# Altium project DevKitWRM1470-r1.0.PrjPcb
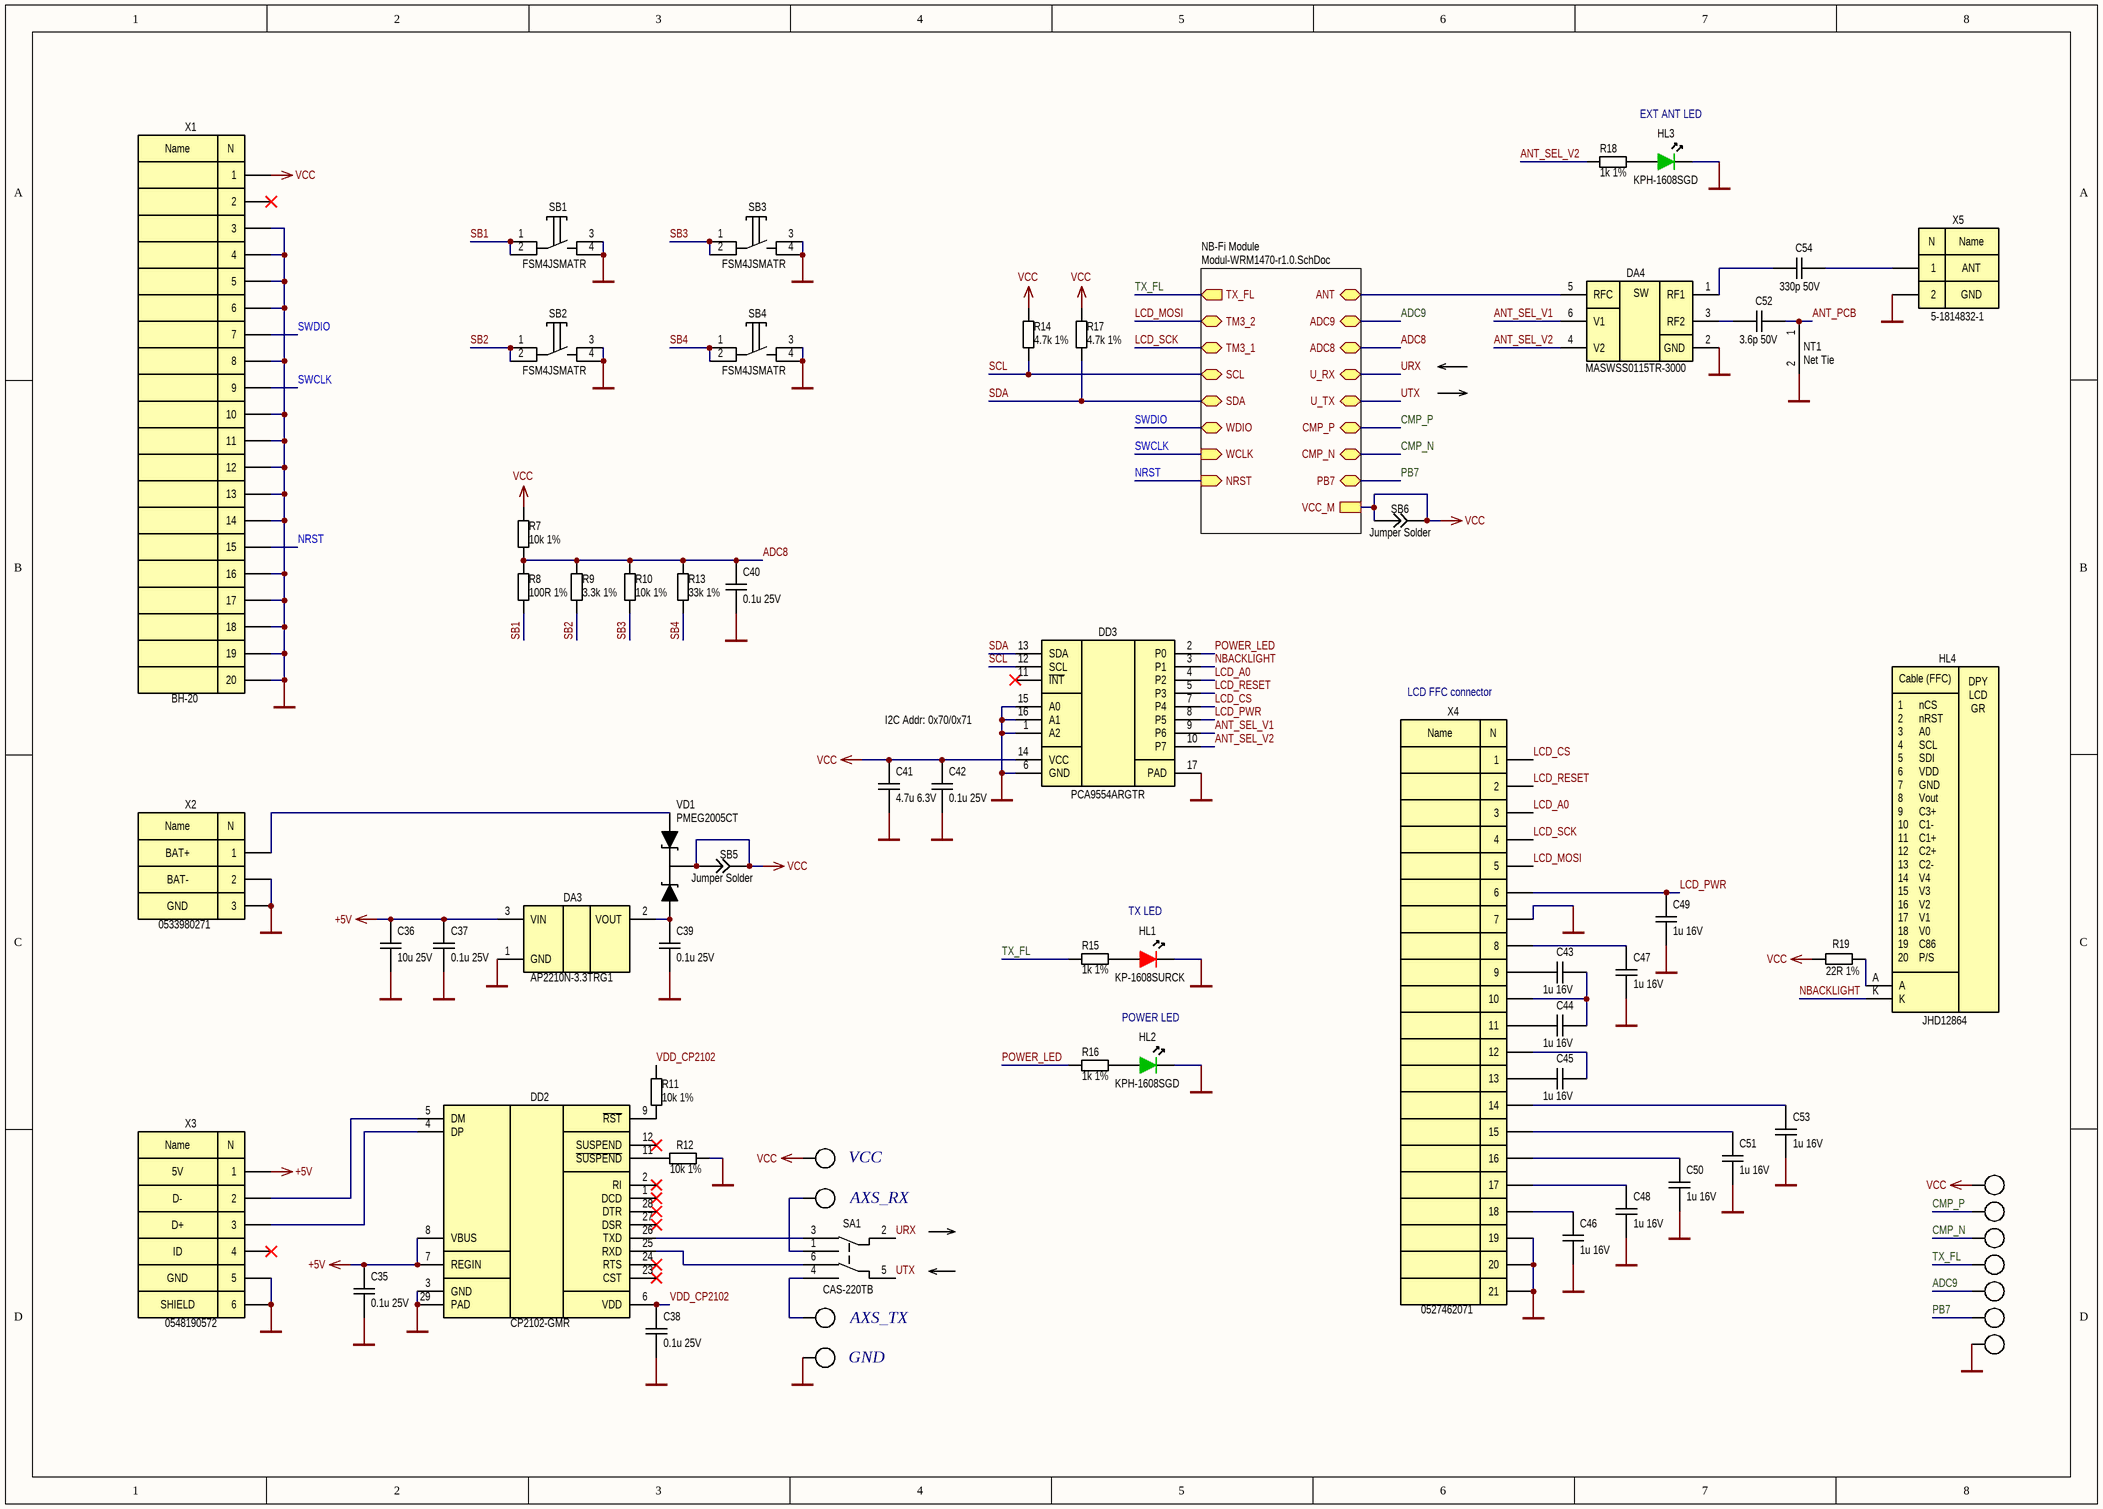
[diagram p0: DevKitWRM1470-r1.0.SchDoc]
2 sheets, 147 parts. Net scope: hierarchical (ports join the sheet entries above them; power ports are global).
Board file: DevKitWRM1470-r1.0.PcbDoc
Sheets:
  DevKitWRM1470-r1.0.SchDoc
    NB-Fi Module = Modul-WRM1470-r1.0.SchDoc

## Sheet DevKitWRM1470-r1.0.SchDoc
size A3; SheetNumber: 1; PageSetup: Record=PageOptions|CenterHorizontal=True|CenterVertical=True|PrintScale=0.52|XCorrection=1.00|YCorrection=1.00|PrintKind=1|BorderSize=5000000|LeftOffset=0|BottomOffset=0|Orientation=2|PaperLength=1000|PaperWidth=1000|Scale=100|PaperSource=7|PrintQuality=600|MediaType=1|DitherType=10|PaperKind=A4|PrintScaleMode=1

### Parts
C35  0.1u 25V  [C0402]
C36  10u 25V  [C0805]
C37  0.1u 25V  [C0402]
C38  0.1u 25V  [C0402]
C39  0.1u 25V  [C0402]
C40  0.1u 25V  [C0402]
C41  4.7u 6.3V  [C0402]
C42  0.1u 25V  [C0402]
C43  1u 16V  [C0402]
C44  1u 16V  [C0402]
C45  1u 16V  [C0402]
C46  1u 16V  [C0402]
C47  1u 16V  [C0402]
C48  1u 16V  [C0402]
C49  1u 16V  [C0402]
C50  1u 16V  [C0402]
C51  1u 16V  [C0402]
C52  3.6p 50V  [C0402]
C53  1u 16V  [C0402]
C54  330p 50V  [C0402]
DA3  AP2210N-3.3TRG1  [SOT23-3L]
DA4  MASWSS0115TR-3000  [SOT323-6]
DD2  CP2102-GMR  [QFN28]
DD3  PCA9554ARGTR  [QFN16]
HL1  KP-1608SURCK  [LED0603_RED]
HL2  KPH-1608SGD  [LED0603_GREEN]
HL3  KPH-1608SGD  [LED0603_GREEN]
HL4  JHD12864  [JHD12864]
NT1  Net Tie  [NETTIE-5.0x4.0]  (net tie, no BOM)
R7  10k 1%  [R0402]
R8  100R 1%  [R0402]
R9  3.3k 1%  [R0402]
R10  10k 1%  [R0402]
R11  10k 1%  [R0402]
R12  10k 1%  [R0402]
R13  33k 1%  [R0402]
R14  4.7k 1%  [R0402]
R15  1k 1%  [R0402]
R16  1k 1%  [R0402]
R17  4.7k 1%  [R0402]
R18  1k 1%  [R0402]
R19  22R 1%  [R0402]
SA1  CAS-220TB  [CAS-220]
SB1  FSM4JSMATR  [FSM4JSMATR]
SB2  FSM4JSMATR  [FSM4JSMATR]
SB3  FSM4JSMATR  [FSM4JSMATR]
SB4  FSM4JSMATR  [FSM4JSMATR]
SB5  Jumper Solder  [SB0805]  (no BOM)
SB6  Jumper Solder  [SB0805]  (no BOM)
VD1  PMEG2005CT  [SOT23-3L]
X1  BH-20  [BH-20_PCB]
X2  0533980271  [0533980271_PCB]
X3  0548190572  [0548190572]
X4  0527462071  [0527462071_PCB]
X5  5-1814832-1  [5-1814832-1]
XP1  PLS-1  [HDR1X1]  (value not drawn)
XP2  PLS-1  [HDR1X1]  (value not drawn)
XP3  PLS-1  [HDR1X1]  (value not drawn)
XP4  PLS-1  [HDR1X1]  (value not drawn)
XP5  PLS-1  [HDR1X1]  (value not drawn)
XP6  PLS-1  [HDR1X1]  (value not drawn)
XP7  PLS-1  [HDR1X1]  (value not drawn)
XP8  PLS-1  [HDR1X1]  (value not drawn)
XP9  PLS-1  [HDR1X1]  (value not drawn)
XP10  PLS-1  [HDR1X1]  (value not drawn)
XP11  PLS-1  [HDR1X1]  (value not drawn)

### Sub-sheets
NB-Fi Module = Modul-WRM1470-r1.0.SchDoc: ADC8 (bidir), TM3_2 (bidir), ADC9 (bidir), TM3_1 (bidir), SCL (bidir), SDA (bidir), WDIO (bidir), WCLK (in), NRST (in), U_RX (bidir), U_TX (bidir), CMP_P (bidir), CMP_N (bidir), ANT (bidir), TX_FL (out), PB7 (bidir), VCC_M

### Nets
+5V: C35.2 C36.1 C37.2 DA3.3(VIN) DD2.7(REGIN) DD2.8(VBUS) X3.1
GND: C35.1 C36.2 C37.1 C38.1 C39.1 C40.1 C41.1 C42.1 C46.1 C47.1 C48.1 C49.1 C50.1 C51.1 C53.1 DA3.1(GND) DA4.2(GND) DD2.3(GND) DD2.29(PAD) DD3.1(A2) DD3.6(GND) DD3.15(A0) DD3.16(A1) DD3.17(PAD) HL1.2 HL2.2 HL3.2 NT1.2 R12.1 SB1.3 SB1.4 SB2.3 SB2.4 SB3.3 SB3.4 SB4.3 SB4.4 X1.3 X1.4 X1.5 X1.6 X1.8 X1.10 X1.11 X1.12 X1.13 X1.14 X1.16 X1.17 X1.18 X1.19 X1.20 X2.2 X2.3 X3.5 X3.6 X4.7 X4.19 X4.20 X4.21 X5.2 XP2.1 XP11.1
VCC: C41.2 C42.2 DD3.14(VCC) R7.2 R14.2 R17.2 R19.2 SB5.1 SB5.2 SB6.1 SB6.2 VD1.3(K) X1.1 XP3.1 XP8.1 ; sheet NB-Fi Module/VCC_M
ADC8: C40.2 R7.1 R8.2 R9.2 R10.2 R13.2 ; sheet NB-Fi Module/ADC8
ADC9: XP6.1 ; sheet NB-Fi Module/ADC9
ANT_PCB: C52.2 NT1.1
ANT_SEL_V1: DA4.6(V1) DD3.9(P6)
ANT_SEL_V2: DA4.4(V2) DD3.10(P7) R18.1
CMP_N: XP5.1 ; sheet NB-Fi Module/CMP_N
CMP_P: XP9.1 ; sheet NB-Fi Module/CMP_P
LCD_A0: DD3.4(P2) X4.3
LCD_CS: DD3.7(P4) X4.1
LCD_MOSI: X4.5 ; sheet NB-Fi Module/TM3_2
LCD_PWR: C49.2 DD3.8(P5) X4.6
LCD_RESET: DD3.5(P3) X4.2
LCD_SCK: X4.4 ; sheet NB-Fi Module/TM3_1
NBACKLIGHT: DD3.3(P1) HL4.K
NRST: X1.15 ; sheet NB-Fi Module/NRST
PB7: XP7.1 ; sheet NB-Fi Module/PB7
POWER_LED: DD3.2(P0) R16.1
SB1: R8.1 SB1.1 SB1.2
SB2: R9.1 SB2.1 SB2.2
SB3: R10.1 SB3.1 SB3.2
SB4: R13.1 SB4.1 SB4.2
SCL: DD3.12(SCL) R14.1 ; sheet NB-Fi Module/SCL  [project net I2C1_SCL]
SDA: DD3.13(SDA) R17.1 ; sheet NB-Fi Module/SDA  [project net I2C1_SDA]
SWCLK: X1.9 ; sheet NB-Fi Module/WCLK
SWDIO: X1.7 ; sheet NB-Fi Module/WDIO
TX_FL: R15.1 XP10.1 ; sheet NB-Fi Module/TX_FL  [project net TX_EN]
URX: SA1.2 ; sheet NB-Fi Module/U_RX  [project net LPUART1_RX]
UTX: SA1.5 ; sheet NB-Fi Module/U_TX  [project net LPUART1_TX]
VDD_CP2102: C38.2 DD2.6(VDD) R11.2
NetC34_1: DA4.5(RFC) ; sheet NB-Fi Module/ANT
NetC39_2: C39.2 DA3.2(VOUT) VD1.2(A2)
NetC43_1: C43.1 C44.1 X4.10
NetC43_2: C43.2 X4.9
NetC44_2: C44.2 X4.11
NetC45_1: C45.1 X4.12
NetC45_2: C45.2 X4.13
NetC46_2: C46.2 X4.18
NetC47_2: C47.2 X4.8
NetC48_2: C48.2 X4.17
NetC50_2: C50.2 X4.16
NetC51_2: C51.2 X4.15
NetC52_1: C52.1 DA4.3(RF2)
NetC53_2: C53.2 X4.14
NetC54_1: C54.1 X5.1
NetC54_2: C54.2 DA4.1(RF1)
NetDD2_4: DD2.4(DP) X3.3
NetDD2_5: DD2.5(DM) X3.2
NetDD2_9: DD2.9(~{RST}) R11.1
NetDD2_11: DD2.11(~{SUSPEND}) R12.2
NetDD2_25: DD2.25(RXD) SA1.6
NetDD2_26: DD2.26(TXD) SA1.3
NetHL1_1: HL1.1 R15.2
NetHL2_1: HL2.1 R16.2
NetHL3_1: HL3.1 R18.2
NetHL4_A: HL4.A R19.1
NetSA1_1: SA1.1 XP4.1
NetSA1_4: SA1.4 XP1.1
NetVD1_1: VD1.1(A1) X2.1

Not connected (* = marked no-connect by the designer): DD2 1(DCD)* 2(RI)* 12(SUSPEND)* 23(CST)* 24(RTS)* 27(DSR)* 28(DTR)*; DD3 11(~{INT})*; X1 2*; X3 4*

### Notes on the sheet
- EXT ANT LED
- I2C Addr: 0x70/0x71
- LCD FFC connector
- BAT+
- BAT-
- GND
- TX LED
- POWER LED
- VCC
- AXS_RX
- AXS_TX
- (in symbol 5-1814832-1) N; Name; ANT; GND
- (in symbol 0527462071) Name; N
- (in symbol 0533980271) Name; N
- (in symbol 0548190572) Name; N; 5V; D-; D+; ID; GND; SHIELD
- (in symbol BH-20) Name; N
- (in symbol JHD12864) Cable (FFC); 1; nCS; DPY / LCD / GR; 2; nRST; 3; A0; 4; SCL; 5; SDI; 6; VDD; 7; GND; 8; Vout; 9; C3+; 10; C1-; 11; C1+; 12; C2+; 13; C2-; 14; V4; 15; V3; 16; V2; 17; V1; 18; V0; 19; C86; 20; P/S
- (in symbol MASWSS0115x) SW

### Library data of the parts
C35 C37-C40 C42 = CC0402KRX7R8BB104: CAP CER 0.1UF 25V X7R 0402; PartNumber: CC0402KRX7R8BB104
C36 = CL21A106KAFN3NE: CAP CER 10UF 25V X5R 0805; PartNumber: CL21A106KAFN3NE
C41 = CC0402KRX5R5BB475: CAP CER 4.7UF 6.3V X5R 0402; PartNumber: CC0402KRX5R5BB475
C43-C51 C53 = CC0402KRX5R7BB105: CAP CER 1UF 16V X5R 0402; PartNumber: CC0402KRX5R7BB105
C52 = CC0402BRNPO9BN3R6: CAP CER 3.6PF 50V NPO 0402; PartNumber: CC0402BRNPO9BN3R6
C54 = CC0402JRNPO9BN331: CAP CER 330PF 50V C0G/NPO 0402; PartNumber: CC0402JRNPO9BN331
DA3 = AP2210N-3.3TRG1: IC REG LINEAR 3.3V 300MA SOT23-3; PartNumber: AP2210N-3.3TRG1
DA4 = MASWSS0115x: RF Switch ICs DC-3.0GHz ISO 22dB IL <.3dB @ 2.4GHz; PartNumber: MASWSS0115TR-3000
DD2 = CP2102-GMR: IC USB-TO-UART BRIDGE 28VQFN; PartNumber: CP2102-GMR
DD3 = PCA9554ARGTR: IC I/O EXPANDER I2C 8B 16QFN; PartNumber: PCA9554ARGTR
HL1 = KP-1608SURCK: LED Red 0603 1.95V Forward voltage typ.; PartNumber: KP-1608SURCK
HL2 HL3 = KPH-1608SGD: Led Green 0603 2.2V Forward voltage typ.; PartNumber: KPH-1608SGD
HL4 = JHD12864: Display Graphical with LED-backlight; PartNumber: JHD12864
NT1 = NT-1: PCB Net Tie
R7 R10-R12 = RC0402FR-0710KL: RES SMD 10K OHM 1% 1/16W 0402; PartNumber: RC0402FR-0710KL
R8 = RC0402FR-07100RL: RES SMD 100 OHM 1% 1/16W 0402; PartNumber: RC0402FR-07100RL
R9 = RC0402FR-073K3L: RES SMD 3.3K OHM 1% 1/16W 0402; PartNumber: RC0402FR-073K3L
R13 = RC0402FR-0733KL: RES SMD 33K OHM 1% 1/16W 0402; PartNumber: RC0402FR-0733KL
R14 R17 = RC0402FR-074K7L: RES SMD 4.7K OHM 1% 1/16W 0402; PartNumber: RC0402FR-07470RL
R15 R16 R18 = RC0402FR-071KL: RES SMD 1K OHM 1% 1/16W 0402; PartNumber: RC0402FR-071KL
R19 = RC0402FR-0722RL: RES SMD 22 OHM 1% 1/16W 0402; PartNumber: RC0402FR-0722RL
SA1 = CAS-220TB: SWITCH SLIDE DPDT 100MA 6V; PartNumber: CAS-220TB
SB1-SB4 = FSM4JSMATR: SWITCH TACTILE SPST-NO 0.05A 24V; PartNumber: FSM4JSMATR
SB5 SB6 = JS_0805: Jumper Solder 0805; Value: *
VD1 = PMEG2005CT: DIODE ARRAY SCHOTTKY 20V SOT23; PartNumber: PMEG2005CT
X1 = BH-20: CONN MALE 20POS 2.54 (IDC-20MS); PartNumber: BH-20
X2 = 0533980271: CONN HEADER SMD 2POS 1.25MM; PartNumber: PLS-3
X3 = 0548190572: CONN RCPT USB2.0 MINI B SMD R/A; PartNumber: 0548190572
X4 = 0527462071: CONN FFC BOTTOM 20POS 0.50MM R/A; PartNumber: 0527462071
X5 = 5-1814832-1: CONN SMA JACK STR 50 OHM PCB; PartNumber: 5-1814832-1

## Sheet Modul-WRM1470-r1.0.SchDoc: Радиомодуль NB-Fi
size 420 x 297 mm; CompanyName: Телематические решения; Address1: Address1; Address2: Address2; Address3: Address3; Address4: Address4; DocumentNumber: XXXX.012345.007Э3; SheetNumber: 2; SheetTotal: 1; Scale: 1:1; Title2str: RM6-r1.0; DocumentType: Схема электрическая принципиальная; FirstReferrence: АБВГ.123456.001
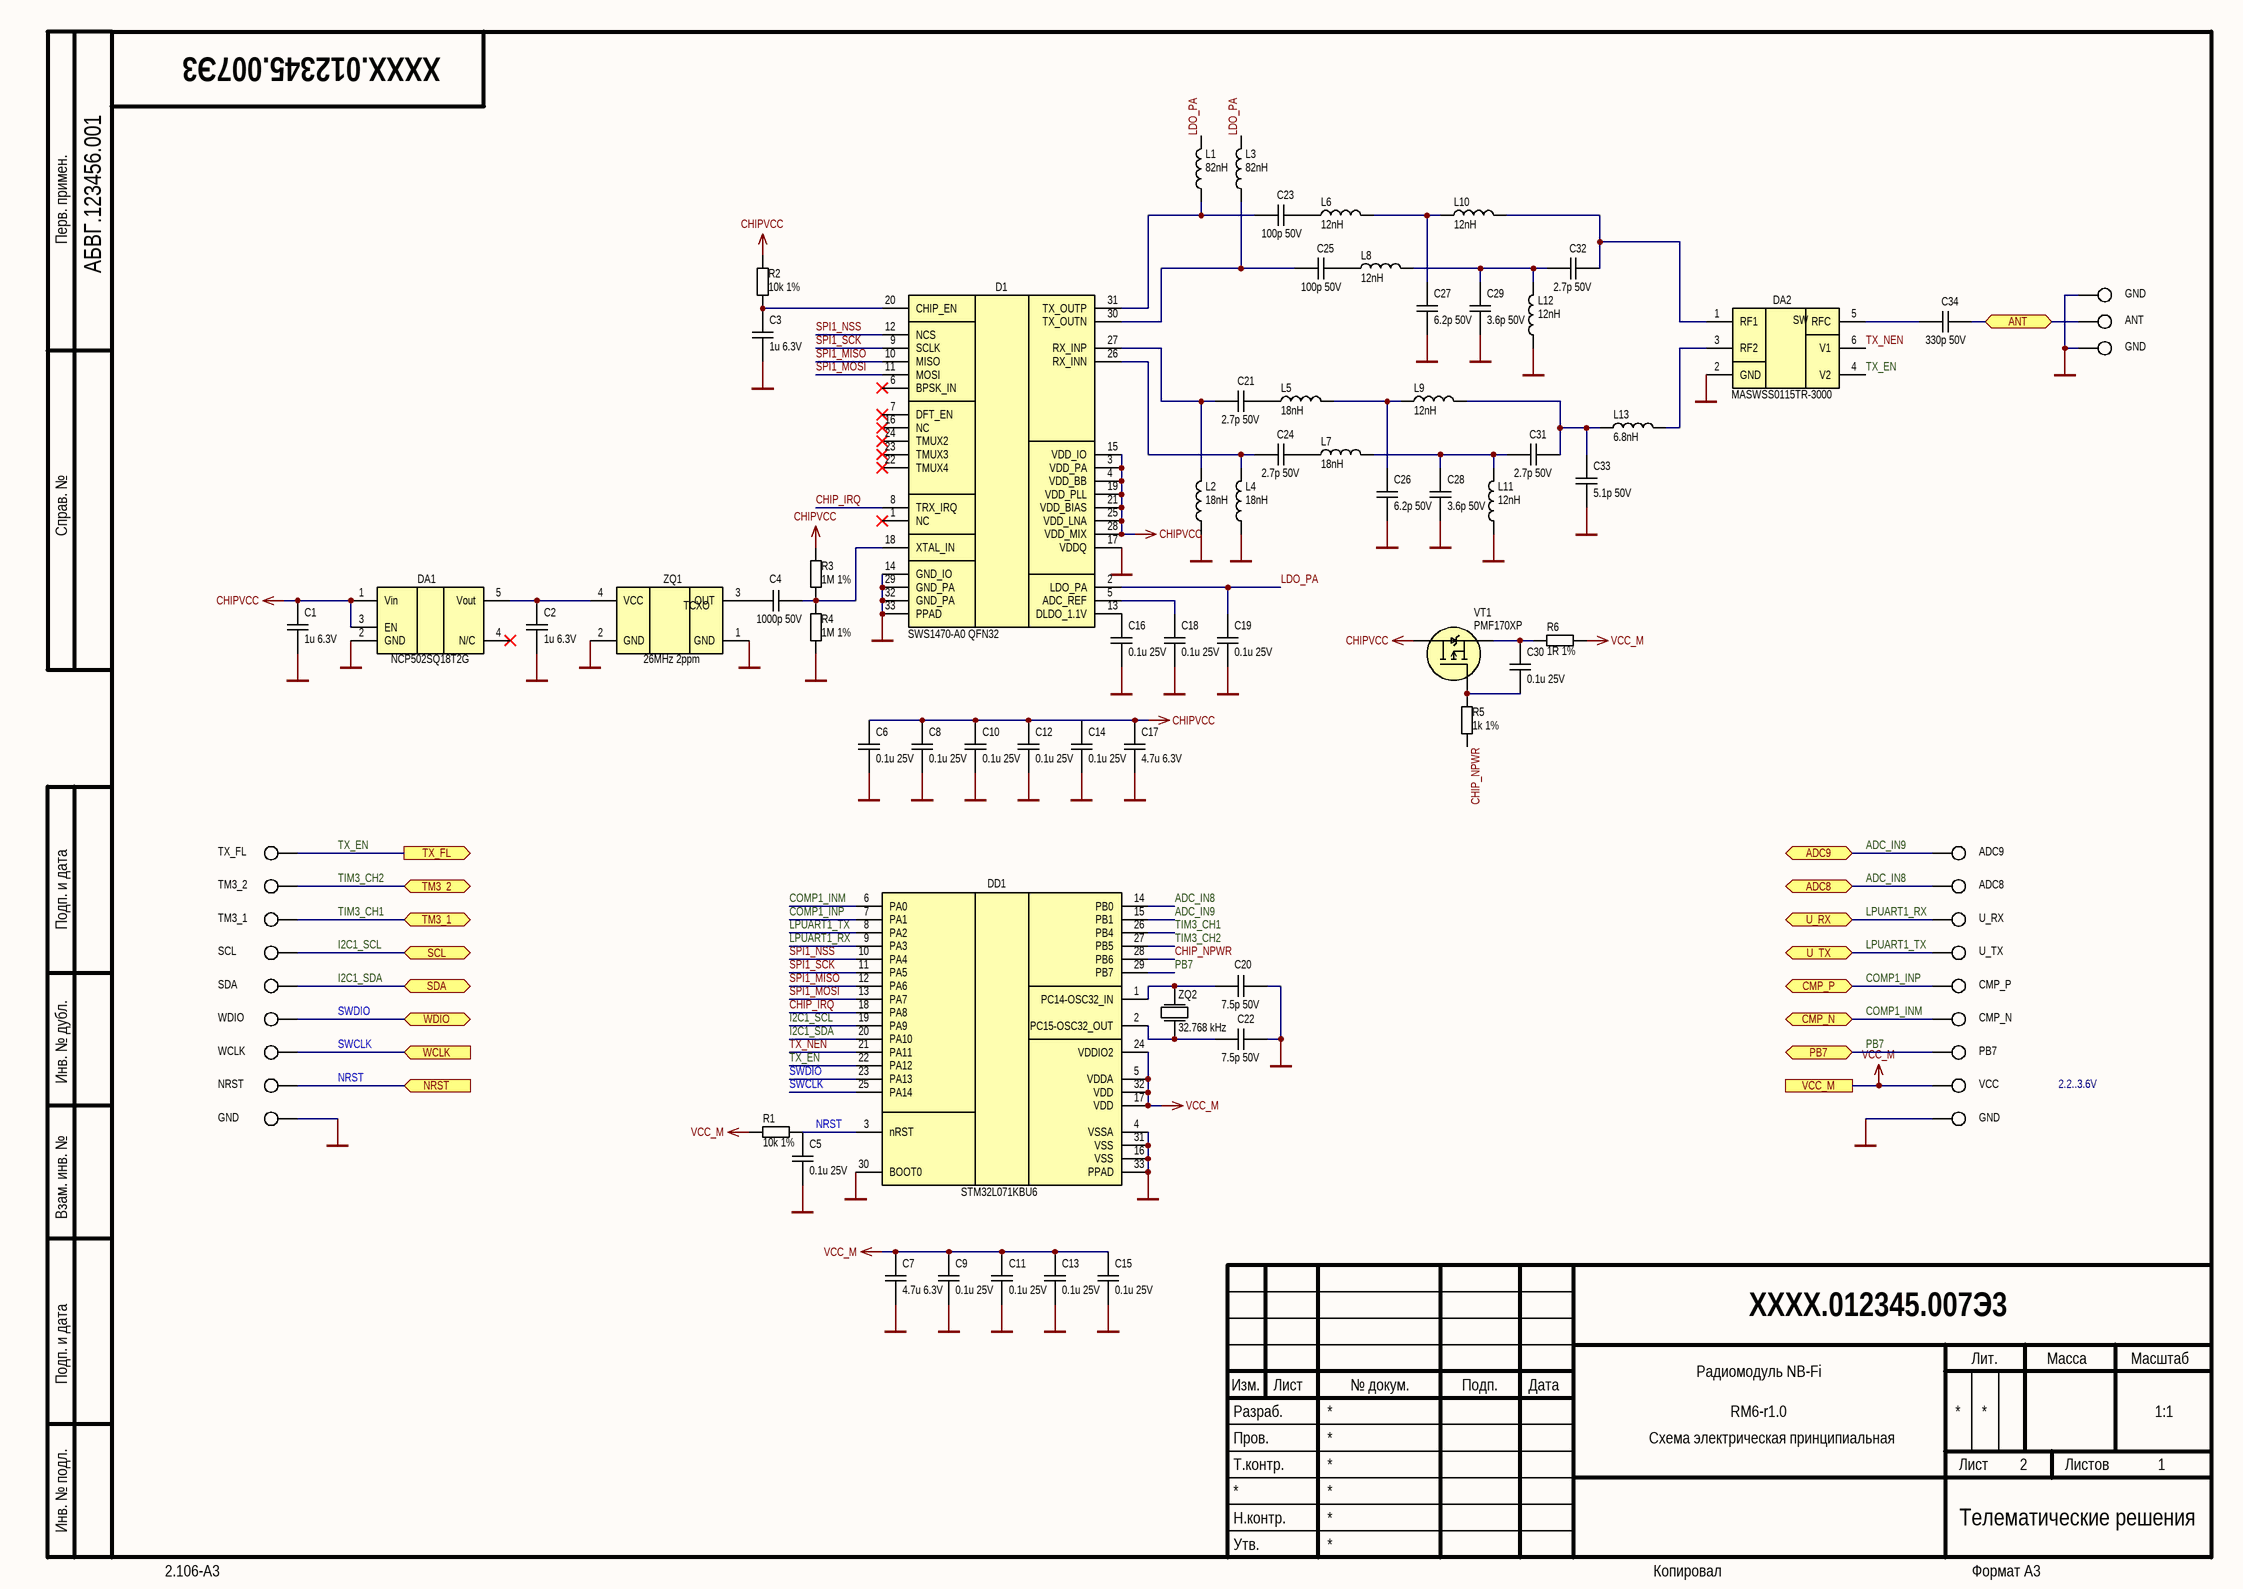
[diagram p1: Modul-WRM1470-r1.0.SchDoc]

### Parts
C1  1u 6.3V  [C0402]
C2  1u 6.3V  [C0402]
C3  1u 6.3V  [C0402]
C4  1000p 50V  [C0402]
C5  0.1u 25V  [C0402]
C6  0.1u 25V  [C0402]
C7  4.7u 6.3V  [C0402]
C8  0.1u 25V  [C0402]
C9  0.1u 25V  [C0402]
C10  0.1u 25V  [C0402]
C11  0.1u 25V  [C0402]
C12  0.1u 25V  [C0402]
C13  0.1u 25V  [C0402]
C14  0.1u 25V  [C0402]
C15  0.1u 25V  [C0402]
C16  0.1u 25V  [C0402]
C17  4.7u 6.3V  [C0402]
C18  0.1u 25V  [C0402]
C19  0.1u 25V  [C0402]
C20  7.5p 50V  [C0402]
C21  2.7p 50V  [C0402]
C22  7.5p 50V  [C0402]
C23  100p 50V  [C0402]
C24  2.7p 50V  [C0402]
C25  100p 50V  [C0402]
C26  6.2p 50V  [C0402]
C27  6.2p 50V  [C0402]
C28  3.6p 50V  [C0402]
C29  3.6p 50V  [C0402]
C30  0.1u 25V  [C0402]
C31  2.7p 50V  [C0402]
C32  2.7p 50V  [C0402]
C33  5.1p 50V  [C0402]
C34  330p 50V  [C0402]
D1  SWS1470-A0 QFN32  [QFN32]
DA1  NCP502SQ18T2G  [SOT323-5]
DA2  MASWSS0115TR-3000  [SOT323-6]
DD1  STM32L071KBU6  [UFQFPN32]
L1  82nH  [L0402_LQW]
L2  18nH  [L0402_LQW]
L3  82nH  [L0402_LQW]
L4  18nH  [L0402_LQW]
L5  18nH  [L0402_LQW]
L6  12nH  [L0402_LQW]
L7  18nH  [L0402_LQW]
L8  12nH  [L0402_LQW]
L9  12nH  [L0402_LQW]
L10  12nH  [L0402_LQW]
L11  12nH  [L0402_LQW]
L12  12nH  [L0402_LQW]
L13  6.8nH  [L0402_LQW]
R1  10k 1%  [R0402]
R2  10k 1%  [R0402]
R3  1M 1%  [R0402]
R4  1M 1%  [R0402]
R5  1k 1%  [R0402]
R6  1R 1%  [R0402]
VT1  PMF170XP  [SOT323]
X1_1  TX_FL  [PAD-d0.6-h1.1-l1.2]
X2_1  TM3_2  [PAD-d0.6-h1.1-l1.2]
X3_1  TM3_1  [PAD-d0.6-h1.1-l1.2]
X4_1  SCL  [PAD-d0.6-h1.1-l1.2]
X5_1  SDA  [PAD-d0.6-h1.1-l1.2]
X6_1  WDIO  [PAD-d0.6-h1.1-l1.2]
X7_1  WCLK  [PAD-d0.6-h1.1-l1.2]
X8_1  NRST  [PAD-d0.6-h1.1-l1.2]
X9_1  GND  [PAD-d0.6-h1.1-l1.2]
X10_1  GND  [PAD-d0.6-h1.1-l1.2]
X11_1  VCC  [PAD-d0.6-h1.1-l1.2]
X12_1  PB7  [PAD-d0.6-h1.1-l1.2]
X13_1  CMP_N  [PAD-d0.6-h1.1-l1.2]
X14_1  CMP_P  [PAD-d0.6-h1.1-l1.2]
X15_1  U_TX  [PAD-d0.6-h1.1-l1.2]
X16_1  U_RX  [PAD-d0.6-h1.1-l1.2]
X17_1  ADC8  [PAD-d0.6-h1.1-l1.2]
X18_1  ADC9  [PAD-d0.6-h1.1-l1.2]
X19_1  GND  [PAD-d0.6-h1.1-l1.2]
X20_1  ANT  [PAD-d0.6-h1.1-l1.2]
X21_1  GND  [PAD-d0.6-h1.1-l1.2]
ZQ1  26MHz 2ppm  [QSMD2.0x1.6x0.7]
ZQ2  32.768 kHz  [QSMD3.2X1.5X0.8]

### Ports
ADC8 (bidir), ADC9 (bidir), ANT (bidir), CMP_N (bidir), CMP_P (bidir), NRST (in), PB7 (bidir), SCL (bidir), SDA (bidir), TM3_1 (bidir), TM3_2 (bidir), TX_FL (out), U_RX (bidir), U_TX (bidir), VCC_M, WCLK (in), WDIO (bidir)

### Nets
CHIPVCC: C1.2 C6.2 C8.2 C10.2 C12.2 C14.2 C17.2 D1.3(VDD_PA) D1.4(VDD_BB) D1.15(VDD_IO) D1.19(VDD_PLL) D1.21(VDD_BIAS) D1.25(VDD_LNA) D1.28(VDD_MIX) DA1.1(Vin) DA1.3(EN) R2.2 R3.2 VT1.3(D)
GND: C1.1 C2.1 C3.1 C5.2 C6.1 C7.2 C8.1 C9.2 C10.1 C11.2 C12.1 C13.2 C14.1 C15.2 C16.1 C17.1 C18.1 C19.1 C20.2 C22.2 C26.2 C27.2 C28.2 C29.2 C33.1 D1.14(GND_IO) D1.17(VDDQ) D1.29(GND_PA) D1.32(GND_PA) D1.33(PPAD) DA1.2(GND) DA2.2(GND) DD1.4(VSSA) DD1.16(VSS) DD1.30(BOOT0) DD1.31(VSS) DD1.33(PPAD) L2.2 L4.2 L11.1 L12.1 R4.1 X9_1.1 X10_1.1 X19_1.1 X21_1.1 ZQ1.1(GND) ZQ1.2(GND)
VCC_M: C7.1 C9.1 C11.1 C13.1 C15.1 DD1.5(VDDA) DD1.17(VDD) DD1.24(VDDIO2) DD1.32(VDD) R1.1 R6.1 X11_1.1 ; port VCC_M  [project net VCC]
ADC_IN8: DD1.14(PB0) X17_1.1 ; port ADC8  [project net ADC8]
ADC_IN9: DD1.15(PB1) X18_1.1 ; port ADC9  [project net ADC9]
CHIP_IRQ: D1.8(TRX_IRQ) DD1.18(PA8)
CHIP_NPWR: DD1.28(PB6) R5.1
COMP1_INM: DD1.6(PA0) X13_1.1 ; port CMP_N  [project net CMP_N]
COMP1_INP: DD1.7(PA1) X14_1.1 ; port CMP_P  [project net CMP_P]
I2C1_SCL: DD1.19(PA9) X4_1.1 ; port SCL
I2C1_SDA: DD1.20(PA10) X5_1.1 ; port SDA
LDO_PA: C19.2 D1.2(LDO_PA) L1.2 L3.2
LPUART1_RX: DD1.9(PA3) X16_1.1 ; port U_RX
LPUART1_TX: DD1.8(PA2) X15_1.1 ; port U_TX
NRST: C5.1 DD1.3(nRST) R1.2 X8_1.1 ; port NRST
PB7: DD1.29(PB7) X12_1.1 ; port PB7
SPI1_MISO: D1.10(MISO) DD1.12(PA6)
SPI1_MOSI: D1.11(MOSI) DD1.13(PA7)
SPI1_NSS: D1.12(NCS) DD1.10(PA4)
SPI1_SCK: D1.9(SCLK) DD1.11(PA5)
SWCLK: DD1.25(PA14) X7_1.1 ; port WCLK
SWDIO: DD1.23(PA13) X6_1.1 ; port WDIO
TIM3_CH1: DD1.26(PB4) X3_1.1 ; port TM3_1  [project net LCD_SCK]
TIM3_CH2: DD1.27(PB5) X2_1.1 ; port TM3_2  [project net LCD_MOSI]
TX_EN: DA2.4(V2) DD1.22(PA12) X1_1.1 ; port TX_FL
TX_NEN: DA2.6(V1) DD1.21(PA11)
NetC2_2: C2.2 DA1.5(Vout) ZQ1.4(VCC)
NetC3_2: C3.2 D1.20(CHIP_EN) R2.1
NetC4_1: C4.1 ZQ1.3(OUT)
NetC4_2: C4.2 D1.18(XTAL_IN) R3.1 R4.2
NetC16_2: C16.2 D1.13(DLDO_1.1V)
NetC18_2: C18.2 D1.5(ADC_REF)
NetC20_1: C20.1 DD1.1(PC14-OSC32_IN) ZQ2.1
NetC21_1: C21.1 D1.27(RX_INP) L2.1
NetC21_2: C21.2 L5.1
NetC22_1: C22.1 DD1.2(PC15-OSC32_OUT) ZQ2.3
NetC23_1: C23.1 D1.31(TX_OUTP) L1.1
NetC23_2: C23.2 L6.1
NetC24_1: C24.1 D1.26(RX_INN) L4.1
NetC24_2: C24.2 L7.1
NetC25_1: C25.1 D1.30(TX_OUTN) L3.1
NetC25_2: C25.2 L8.1
NetC26_1: C26.1 L5.2 L9.1
NetC27_1: C27.1 L6.2 L10.1
NetC28_1: C28.1 C31.1 L7.2 L11.2
NetC29_1: C29.1 C32.1 L8.2 L12.2
NetC30_1: C30.1 R5.2 VT1.1(G)
NetC30_2: C30.2 R6.2 VT1.2(S)
NetC31_2: C31.2 C33.2 L9.2 L13.1
NetC32_2: C32.2 DA2.1(RF1) L10.2
NetC34_1: C34.1 X20_1.1 ; port ANT
NetC34_2: C34.2 DA2.5(RFC)
NetDA2_3: DA2.3(RF2) L13.2

Not connected (* = marked no-connect by the designer): D1 1(NC)* 6(BPSK_IN)* 7(DFT_EN)* 16(NC)* 22(TMUX4)* 23(TMUX3)* 24(TMUX2)*; DA1 4(N/C)*

### Notes on the sheet
- 2.2..3.6V
- Перв. примен.
- Справ. №
- Подп. и дата
- Инв. № дубл.
- Взам. инв. №
- Разраб.
- Изм.
- Лист
- № докум.
- Подп.
- Дата
- Лит.
- Масса
- Масштаб
- Пров.
- Т.контр.
- Листов
- Инв. № подл.
- Утв.
- Н.контр.
- 2.106-A3
- Копировал
- Формат А3
- (in symbol MASWSS0115x) SW
- (in symbol NT2016SA-26.000000MHZ-NBG2) TCXO

### Library data of the parts
C1-C3 = CC0402KRX5R5BB105: CAP CER 1UF 6.3V X5R 0402; PartNumber: CC0402KRX5R5BB105
C4 = CC0402JRX7R9BB102: CAP CER 1000PF 50V X7R 0402; PartNumber: CC0402JRX7R9BB102
C5 C6 C8-C16 C18 C19 C30 = CC0402KRX7R8BB104: CAP CER 0.1UF 25V X7R 0402; PartNumber: CC0402KRX7R8BB104
C7 C17 = CC0402KRX5R5BB475: CAP CER 4.7UF 6.3V X5R 0402; PartNumber: CC0402KRX5R5BB475
C20 C22 = CC0402CRNPO9BN7R5: CAP CER 7.5PF 50V C0G/NPO 0402; PartNumber: CC0402CRNPO9BN7R5
C21 C24 C31 C32 = CC0402BRNPO9BN2R7: CAP CER 2.7PF 50V C0G/NPO 0402; PartNumber: CC0402BRNPO9BN2R7
C23 C25 = CC0402JRNPO9BN101: CAP CER 100PF 50V C0G/NPO 0402; PartNumber: CC0402JRNPO9BN101
C26 C27 = CC0402CRNPO9BN6R2: CAP CER 6.2PF 50V NPO 0402; PartNumber: CC0402CRNPO9BN6R2
C28 C29 = CC0402BRNPO9BN3R6: CAP CER 3.6PF 50V NPO 0402; PartNumber: CC0402BRNPO9BN3R6
C33 = CC0402CRNPO9BN5R1: CAP CER 5.1PF 50V C0G/NPO 0402; PartNumber: CC0402CRNPO9BN5R1
C34 = CC0402JRNPO9BN331: CAP CER 330PF 50V C0G/NPO 0402; PartNumber: CC0402JRNPO9BN331
D1 = SWS1470-A0 QFN32: Waviot NB-Fi RF Transceiver QFN32; PartNumber: SWS1470-A0 QFN32
DA1 = NCP502SQ18T2G: IC REG LINEAR 1.8V 80MA SC88A; PartNumber: NCP502SQ18T2G
DA2 = MASWSS0115x: as DA4 on sheet DevKitWRM1470-r1.0; PartNumber: MASWSS0115TR-3000
DD1 = STM32L071KBU6: ARM® Cortex®-M0+ STM32L0 Microcontroller IC 32-Bit 32MHz 128KB (128K x 8) FLASH 32-UFQFPN (5x5); PartNumber: STM32L071KBU6
L1 L3 = LQW15AN82NG00D: FIXED IND 82NH 130MA 2.24 OHM; PartNumber: LQW15AN82NG00D
L2 L4 L5 L7 = LQW15AN18NG00D: FIXED IND 18NH 370MA 270 MOHM; PartNumber: LQW15AN18NG00D
L6 L8-L12 = LQW15AN12NG00D: FIXED IND 12NH 500MA 140 MOHM; PartNumber: LQW15AN12NG00D
L13 = LQW15AN6N8G00D: FIXED IND 6.8NH 700MA 90 MOHM; PartNumber: LQW15AN6N8G00D
R1 R2 = RC0402FR-0710KL: RES SMD 10K OHM 1% 1/16W 0402; PartNumber: RC0402FR-0710KL
R3 R4 = RC0402FR-071ML: RES SMD 1M OHM 1% 1/16W 0402; PartNumber: RC0402FR-071ML
R5 = RC0402FR-071KL: RES SMD 1K OHM 1% 1/16W 0402; PartNumber: RC0402FR-071KL
R6 = RC0402FR-071RL: RES SMD 1 OHM 1% 1/16W 0402; PartNumber: RC0402FR-071RL
VT1 = PMF170XP: MOSFET P-CH 20V 1A SOT323; PartNumber: PMF170XP
X1_1 X2_1 X3_1 X4_1 X5_1 X6_1 X7_1 X8_1 X9_1 X10_1 X11_1 X12_1 X13_1 X14_1 X15_1 X16_1 X17_1 X18_1 X19_1 X20_1 X21_1 = PIN
ZQ1 = NT2016SA-26.000000MHZ-NBG2: TCXO Oscillator 4-pin; PartNumber: NT2016SA-26.000000MHZ-NBG2
ZQ2 = KX-327NHT 32.768 kHz: Crystals 32.768KHz 12.5pF -40C +85C; PartNumber: KX-327NHT 32.768 kHz

## Nets that join several sheets
GND: DevKitWRM1470-r1.0 (63 pins), Modul-WRM1470-r1.0 (48 pins)
VCC: DevKitWRM1470-r1.0 (15 pins), Modul-WRM1470-r1.0 (12 pins)
ADC8: DevKitWRM1470-r1.0 (6 pins), Modul-WRM1470-r1.0 (DD1.14 X17_1.1)
ADC9: DevKitWRM1470-r1.0 (XP6.1), Modul-WRM1470-r1.0 (DD1.15 X18_1.1)
CMP_N: DevKitWRM1470-r1.0 (XP5.1), Modul-WRM1470-r1.0 (DD1.6 X13_1.1)
CMP_P: DevKitWRM1470-r1.0 (XP9.1), Modul-WRM1470-r1.0 (DD1.7 X14_1.1)
I2C1_SCL: DevKitWRM1470-r1.0 (DD3.12 R14.1), Modul-WRM1470-r1.0 (DD1.19 X4_1.1)
I2C1_SDA: DevKitWRM1470-r1.0 (DD3.13 R17.1), Modul-WRM1470-r1.0 (DD1.20 X5_1.1)
LCD_MOSI: DevKitWRM1470-r1.0 (X4.5), Modul-WRM1470-r1.0 (DD1.27 X2_1.1)
LCD_SCK: DevKitWRM1470-r1.0 (X4.4), Modul-WRM1470-r1.0 (DD1.26 X3_1.1)
LPUART1_RX: DevKitWRM1470-r1.0 (SA1.2), Modul-WRM1470-r1.0 (DD1.9 X16_1.1)
LPUART1_TX: DevKitWRM1470-r1.0 (SA1.5), Modul-WRM1470-r1.0 (DD1.8 X15_1.1)
NetC34_1: DevKitWRM1470-r1.0 (DA4.5), Modul-WRM1470-r1.0 (C34.1 X20_1.1)
NRST: DevKitWRM1470-r1.0 (X1.15), Modul-WRM1470-r1.0 (C5.1 DD1.3 R1.2 X8_1.1)
PB7: DevKitWRM1470-r1.0 (XP7.1), Modul-WRM1470-r1.0 (DD1.29 X12_1.1)
SWCLK: DevKitWRM1470-r1.0 (X1.9), Modul-WRM1470-r1.0 (DD1.25 X7_1.1)
SWDIO: DevKitWRM1470-r1.0 (X1.7), Modul-WRM1470-r1.0 (DD1.23 X6_1.1)
TX_EN: DevKitWRM1470-r1.0 (R15.1 XP10.1), Modul-WRM1470-r1.0 (DA2.4 DD1.22 X1_1.1)